# EasyEDA schematic SCH_Temp-and-fan-ctrl_2026-02-23.json
TITLE: Temp and fan control; REV: 1.0; Date: 2026-02-23; Sheet: 1/1; Drawn By: bubnov.mihail; Company: Bubnov Mihail
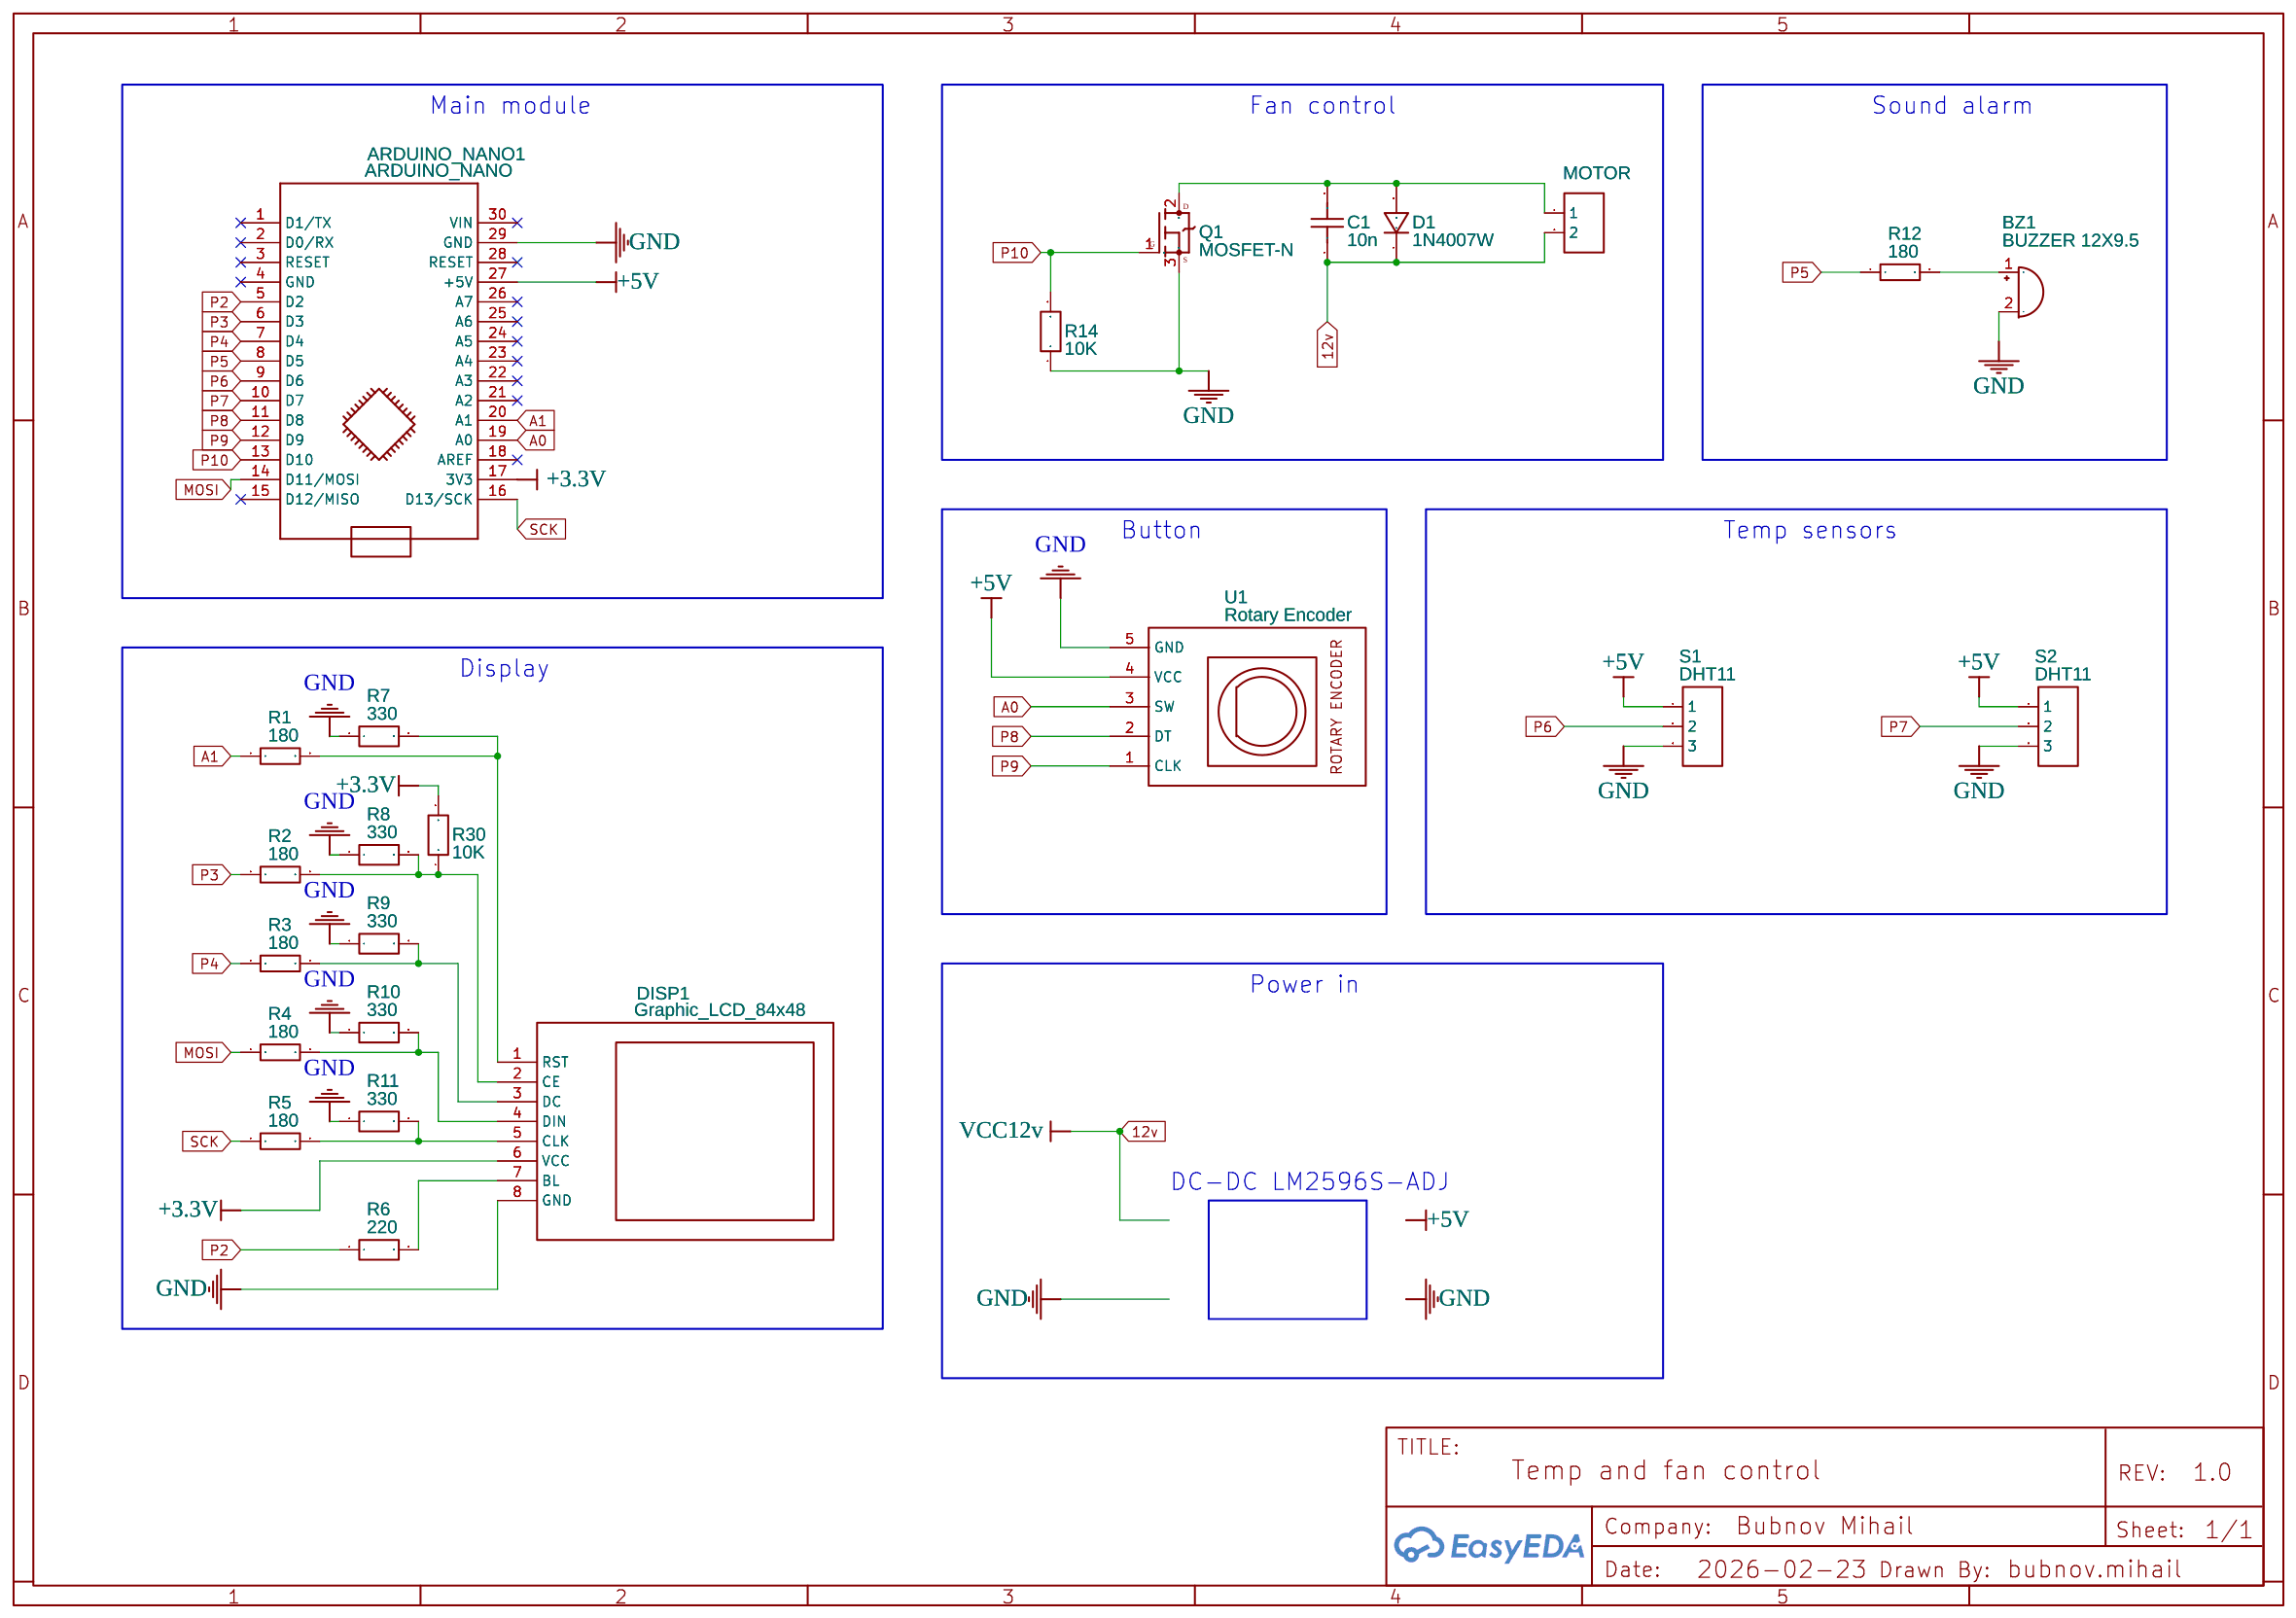
[diagram p0: schematic sheet]

## Parts
ARDUINO_NANO1  ARDUINO_NANO  [ARDUINO_NANO]
BZ1  BUZZER 12X9.5  [BUZZER_BEEPER:BUZZER_12X9.5RM7.6]
C1  10n  [C0603]
D1  1N4007W  [SOD-123_L2.8-W1.8-LS3.7-RD]
DISP1  Graphic_LCD_84x48  [LCD5110]
MOTOR  1-  [CONN-TH_2P-P5.00]
Q1  MOSFET-N  [TO220V]
R1  180  [RES-TH_BD3.0-L9.5-P13.50-D0.6]
R2  180  [RES-TH_BD3.0-L9.5-P13.50-D0.6]
R3  180  [RES-TH_BD3.0-L9.5-P13.50-D0.6]
R4  180  [RES-TH_BD3.0-L9.5-P13.50-D0.6]
R5  180  [RES-TH_BD3.0-L9.5-P13.50-D0.6]
R6  220  [RES-TH_BD2.4-L6.3-P10.30-D0.6]
R7  330  [RES-TH_BD2.4-L6.3-P10.30-D0.6]
R8  330  [RES-TH_BD2.4-L6.3-P10.30-D0.6]
R9  330  [RES-TH_BD2.4-L6.3-P10.30-D0.6]
R10  330  [RES-TH_BD2.4-L6.3-P10.30-D0.6]
R11  330  [RES-TH_BD2.4-L6.3-P10.30-D0.6]
R12  180  [RES-TH_BD3.0-L9.5-P13.50-D0.6]
R14  10K  [RES-TH_BD2.4-L6.3-P10.30-D0.6]
R30  10K  [RES-TH_BD2.4-L6.3-P10.30-D0.6]
S1  DHT11  [HDR-F-2.54_1X3]
S2  DHT11  [HDR-F-2.54_1X3]
U1  Rotary Encoder  [KY-040]

## Library data of the parts
ARDUINO_NANO1 = ARDUINO_NANO: sourceId: KGSeAWhDB
BZ1 = BUZZER 12X9.5 FATHBOARD COPY: Symbol: Device_Buzzer; Device: Device_Buzzer; Add into BOM: yes; Convert to PCB: yes; Origin Footprint: Buzzer_Beeper:Buzzer_12x9.5RM7.6; Contributor: t.teenoom
C1 = C_0603_US: Contributor: LCEDA_Lib
D1 = 1N4007W: Supplier: LCSC; Supplier Part: C328592; Manufacturer: BLUE ROCKET; Contributor: LCEDA_Lib
DISP1 = Graphic_LCD_84x48: Contributor: Николай Сибирцев; Supplier: AliExpress; Price: 1,72; link: https://www.aliexpress.com/item/1pcs-lot-nokia5110-LCD-Module-microcontroller-development-compatible-with-the-Nokia-3310-to-send-data-LCD5110/32812074048.html?spm=a2g0s.13010208.99999999.261.582e3c0074DMg0
MOTOR = CONN-TH_2P-P5.00: Supplier: LCSC; Contributor: LCEDA_Lib
Q1 = MOSFET-N: Contributor: Adafruit
R1-R5 R12 = CFR02SJ0103A10: Supplier: LCSC; Manufacturer: UniOhm; Supplier Part: C69873; LCSC Assembly: Yes; SMT Type: Extend
R6-R11 R14 R30 = RD 1/2WS 10K J T/B A1: Supplier: LCSC; Supplier Part: C433797; Manufacturer: TyoHM; Contributor: LCSC; LCSC Assembly: Yes; SMT Type: Extend
S1 S2 = HDR-F-2.54_1x3: Supplier Part: C146690; Supplier: LCSC; Contributor: LCEDA_Lib
U1 = Rotary Encoder: Contributor: carlo78

## Nets
12v: C1.1 D1.1 MOTOR.2
+3.3V: ARDUINO_NANO1.17(3V3) DISP1.6(VCC) R30.2
+5V: ARDUINO_NANO1.27(+5V) S1.1 S2.1 U1.4(VCC)
GND: ARDUINO_NANO1.29(GND) BZ1.2(-) DISP1.8(GND) Q1.3(S) R7.1 R8.1 R9.1 R10.1 R11.1 R14.1 S1.3 S2.3 U1.5(GND)
A0: ARDUINO_NANO1.19(A0) U1.3(SW)
A1: ARDUINO_NANO1.20(A1) R1.1
MOSI: ARDUINO_NANO1.14(D11/MOSI) R4.1
P2: ARDUINO_NANO1.5(D2) R6.1
P3: ARDUINO_NANO1.6(D3) R2.1
P4: ARDUINO_NANO1.7(D4) R3.1
P5: ARDUINO_NANO1.8(D5) R12.1
P6: ARDUINO_NANO1.9(D6) S1.2
P7: ARDUINO_NANO1.10(D7) S2.2
P8: ARDUINO_NANO1.11(D8) U1.2(DT)
P9: ARDUINO_NANO1.12(D9) U1.1(CLK)
P10: ARDUINO_NANO1.13(D10) Q1.1(G) R14.2
SCK: ARDUINO_NANO1.16(D13/SCK) R5.1
Net-(BZ1-1): BZ1.1(+) R12.2
Net-(C1-2): C1.2 D1.2 MOTOR.1 Q1.2(D)
Net-(DISP1-1): DISP1.1(RST) R1.2 R7.2
Net-(DISP1-2): DISP1.2(CE) R2.2 R8.2 R30.1
Net-(DISP1-3): DISP1.3(DC) R3.2 R9.2
Net-(DISP1-4): DISP1.4(DIN) R4.2 R10.2
Net-(DISP1-5): DISP1.5(CLK) R5.2 R11.2
Net-(DISP1-7): DISP1.7(BL) R6.2

Not connected (* = marked no-connect by the designer): ARDUINO_NANO1 1(D1/TX)* 2(D0/RX)* 3(RESET)* 4(GND)* 15(D12/MISO)* 18(AREF)* 21(A2)* 22(A3)* 23(A4)* 24(A5)* 25(A6)* 26(A7)* 28(RESET)* 30(VIN)*

## Notes on the sheet
- Main module
- Fan control
- Sound alarm
- Button
- Temp sensors
- Display
- Power in
- DC-DC LM2596S-ADJ
